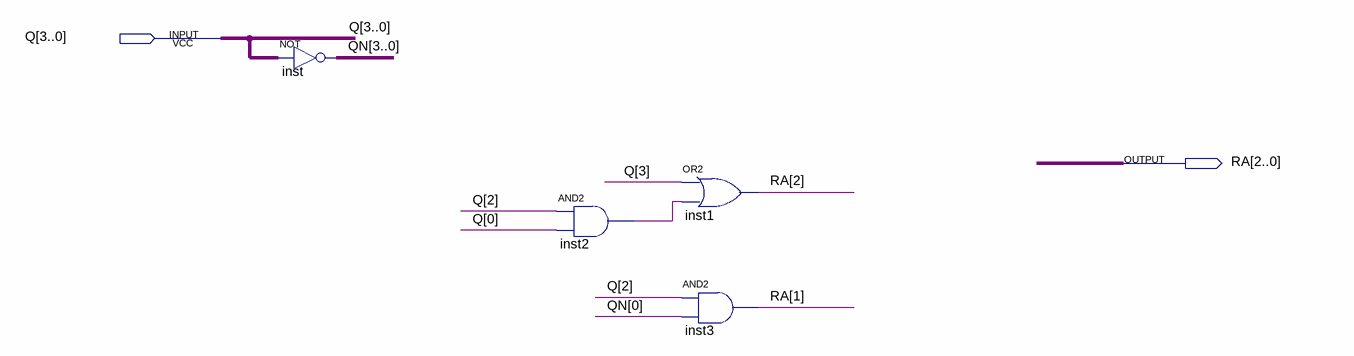
[diagram p0: schematic sheet]
// Quartus schematic RA.bdf as structural Verilog: 4 symbols, 2 pins
module RA (
  input  [3:0] Q,
  output [2:0] RA
);

  wire inst2_out;
  wire [3:0] QN;

  assign QN = ~Q;  // NOT inst, 4 bits wide
  and inst2 (inst2_out, Q[2], Q[0]);
  or inst1 (RA[2], Q[3], inst2_out);
  and inst3 (RA[1], Q[2], QN[0]);
endmodule
